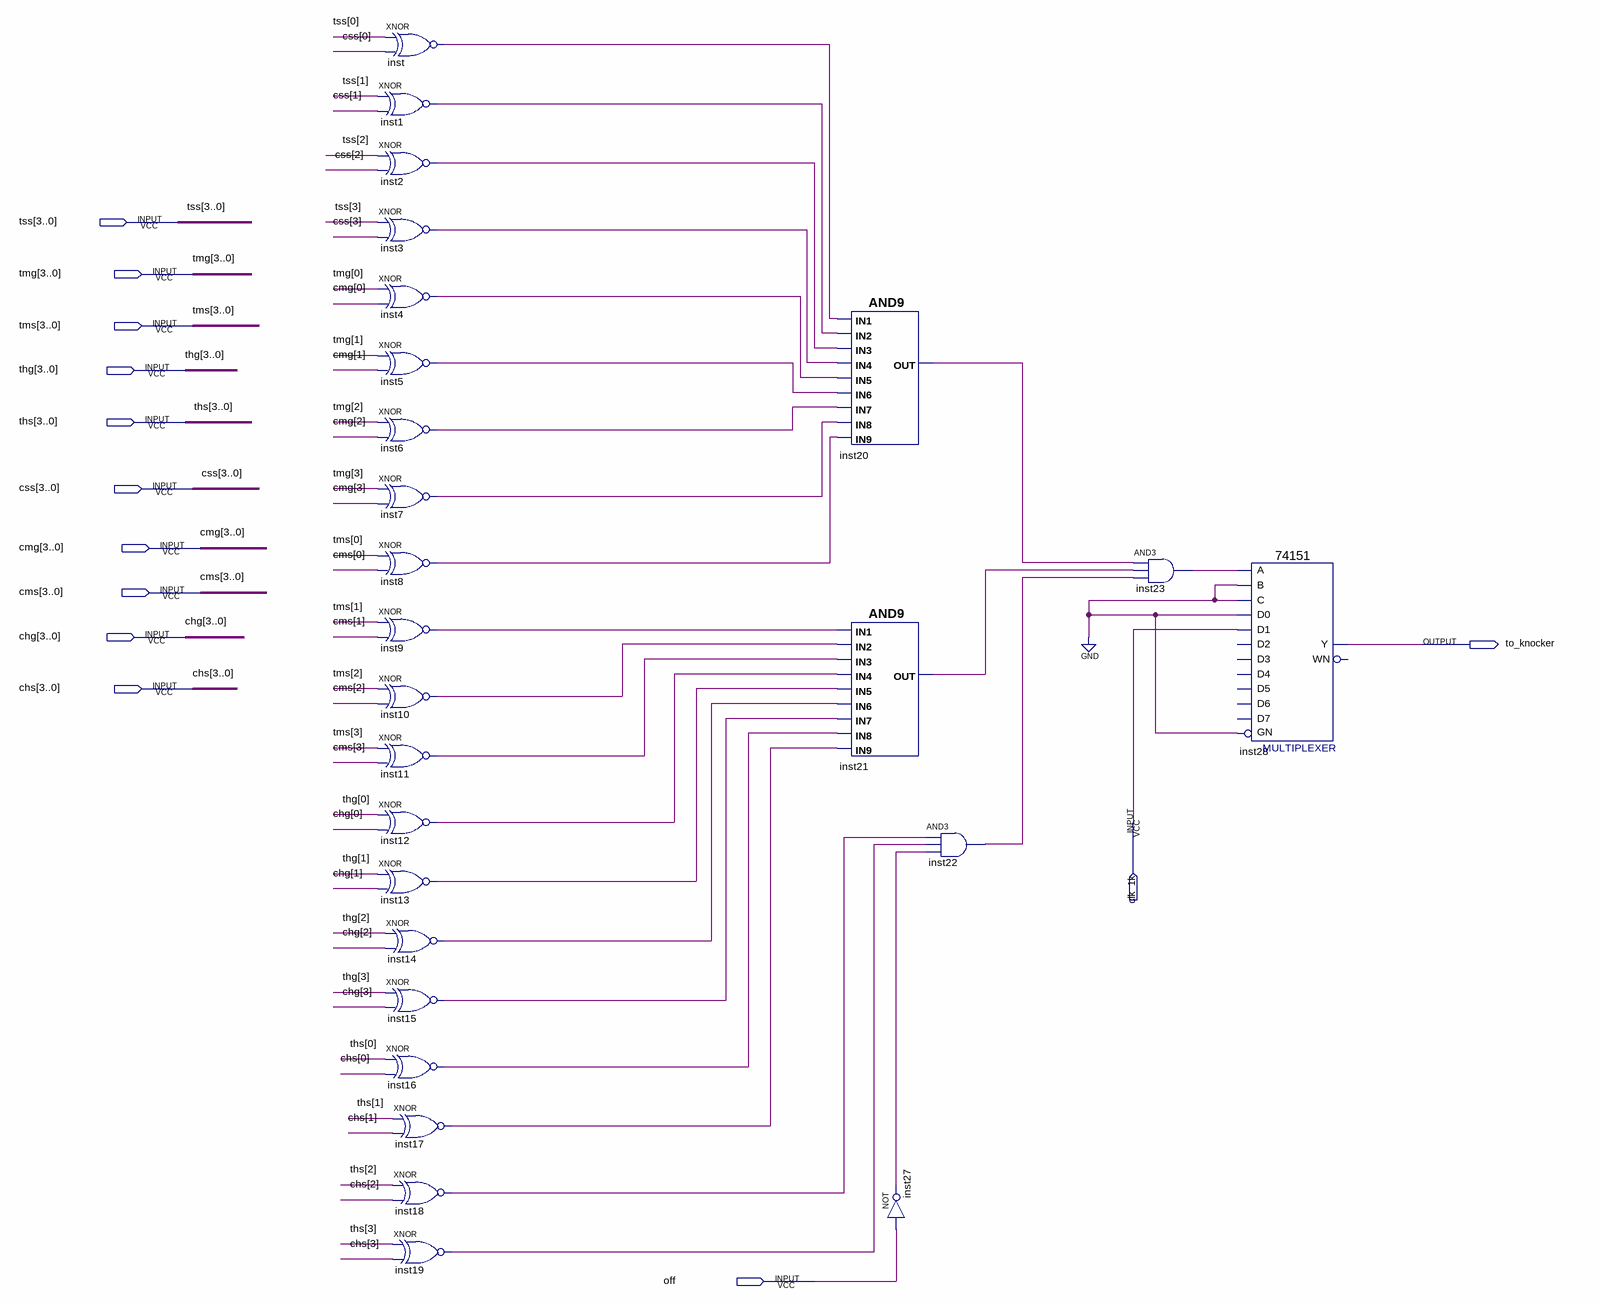
[diagram p0: schematic sheet]
// Quartus schematic bell_judge.bdf as structural Verilog: 26 symbols, 13 pins
module bell_judge (
  input  [3:0] tss,
  input  [3:0] tmg,
  input  [3:0] tms,
  input  [3:0] thg,
  input  [3:0] ths,
  input  [3:0] css,
  input  [3:0] cmg,
  input  [3:0] cms,
  input  [3:0] chg,
  input  [3:0] chs,
  input  clk_1k,
  input  off,
  output to_knocker
);

  wire inst1_out, inst2_out, inst3_out, inst4_out, inst5_out, inst6_out, inst7_out, inst8_out, inst9_out,
       inst10_out, inst11_out, inst12_out, inst13_out, inst14_out, inst15_out, inst16_out, inst17_out,
       inst18_out, inst19_out, inst20_out, inst21_out, inst22_out, inst23_out, inst27_out, inst_out;

  xnor inst (inst_out, tss[0], css[0]);
  xnor inst1 (inst1_out, tss[1], css[1]);
  xnor inst2 (inst2_out, tss[2], css[2]);
  xnor inst3 (inst3_out, tss[3], css[3]);
  xnor inst4 (inst4_out, tmg[0], cmg[0]);
  xnor inst5 (inst5_out, tmg[1], cmg[1]);
  xnor inst6 (inst6_out, tmg[2], cmg[2]);
  xnor inst7 (inst7_out, tmg[3], cmg[3]);
  xnor inst8 (inst8_out, tms[0], cms[0]);
  xnor inst9 (inst9_out, tms[1], cms[1]);
  xnor inst10 (inst10_out, tms[2], cms[2]);
  xnor inst11 (inst11_out, tms[3], cms[3]);
  xnor inst12 (inst12_out, thg[0], chg[0]);
  xnor inst13 (inst13_out, thg[1], chg[1]);
  xnor inst14 (inst14_out, thg[2], chg[2]);
  xnor inst15 (inst15_out, thg[3], chg[3]);
  xnor inst16 (inst16_out, ths[0], chs[0]);
  xnor inst17 (inst17_out, ths[1], chs[1]);
  xnor inst18 (inst18_out, ths[2], chs[2]);
  xnor inst19 (inst19_out, ths[3], chs[3]);
  and inst20 (inst20_out, inst_out, inst1_out, inst2_out, inst3_out, inst4_out, inst5_out, inst6_out, inst7_out, inst8_out);
  and inst21 (inst21_out, inst9_out, inst10_out, inst11_out, inst12_out, inst13_out, inst14_out, inst15_out, inst16_out, inst17_out);
  not inst27 (inst27_out, off);
  and inst22 (inst22_out, inst18_out, inst19_out, inst27_out);
  and inst23 (inst23_out, inst20_out, inst21_out, inst22_out);
  \74151  inst28 (
    .GN(1'b0), .C(1'b0), .B(1'b0), .A(inst23_out), .D0(1'b0), .D1(clk_1k), .Y(to_knocker));  // open: D5, D4, D3, D2, D6, D7, WN
endmodule
